# EAGLE schematic schematic1 (EAGLE 9.5.2)
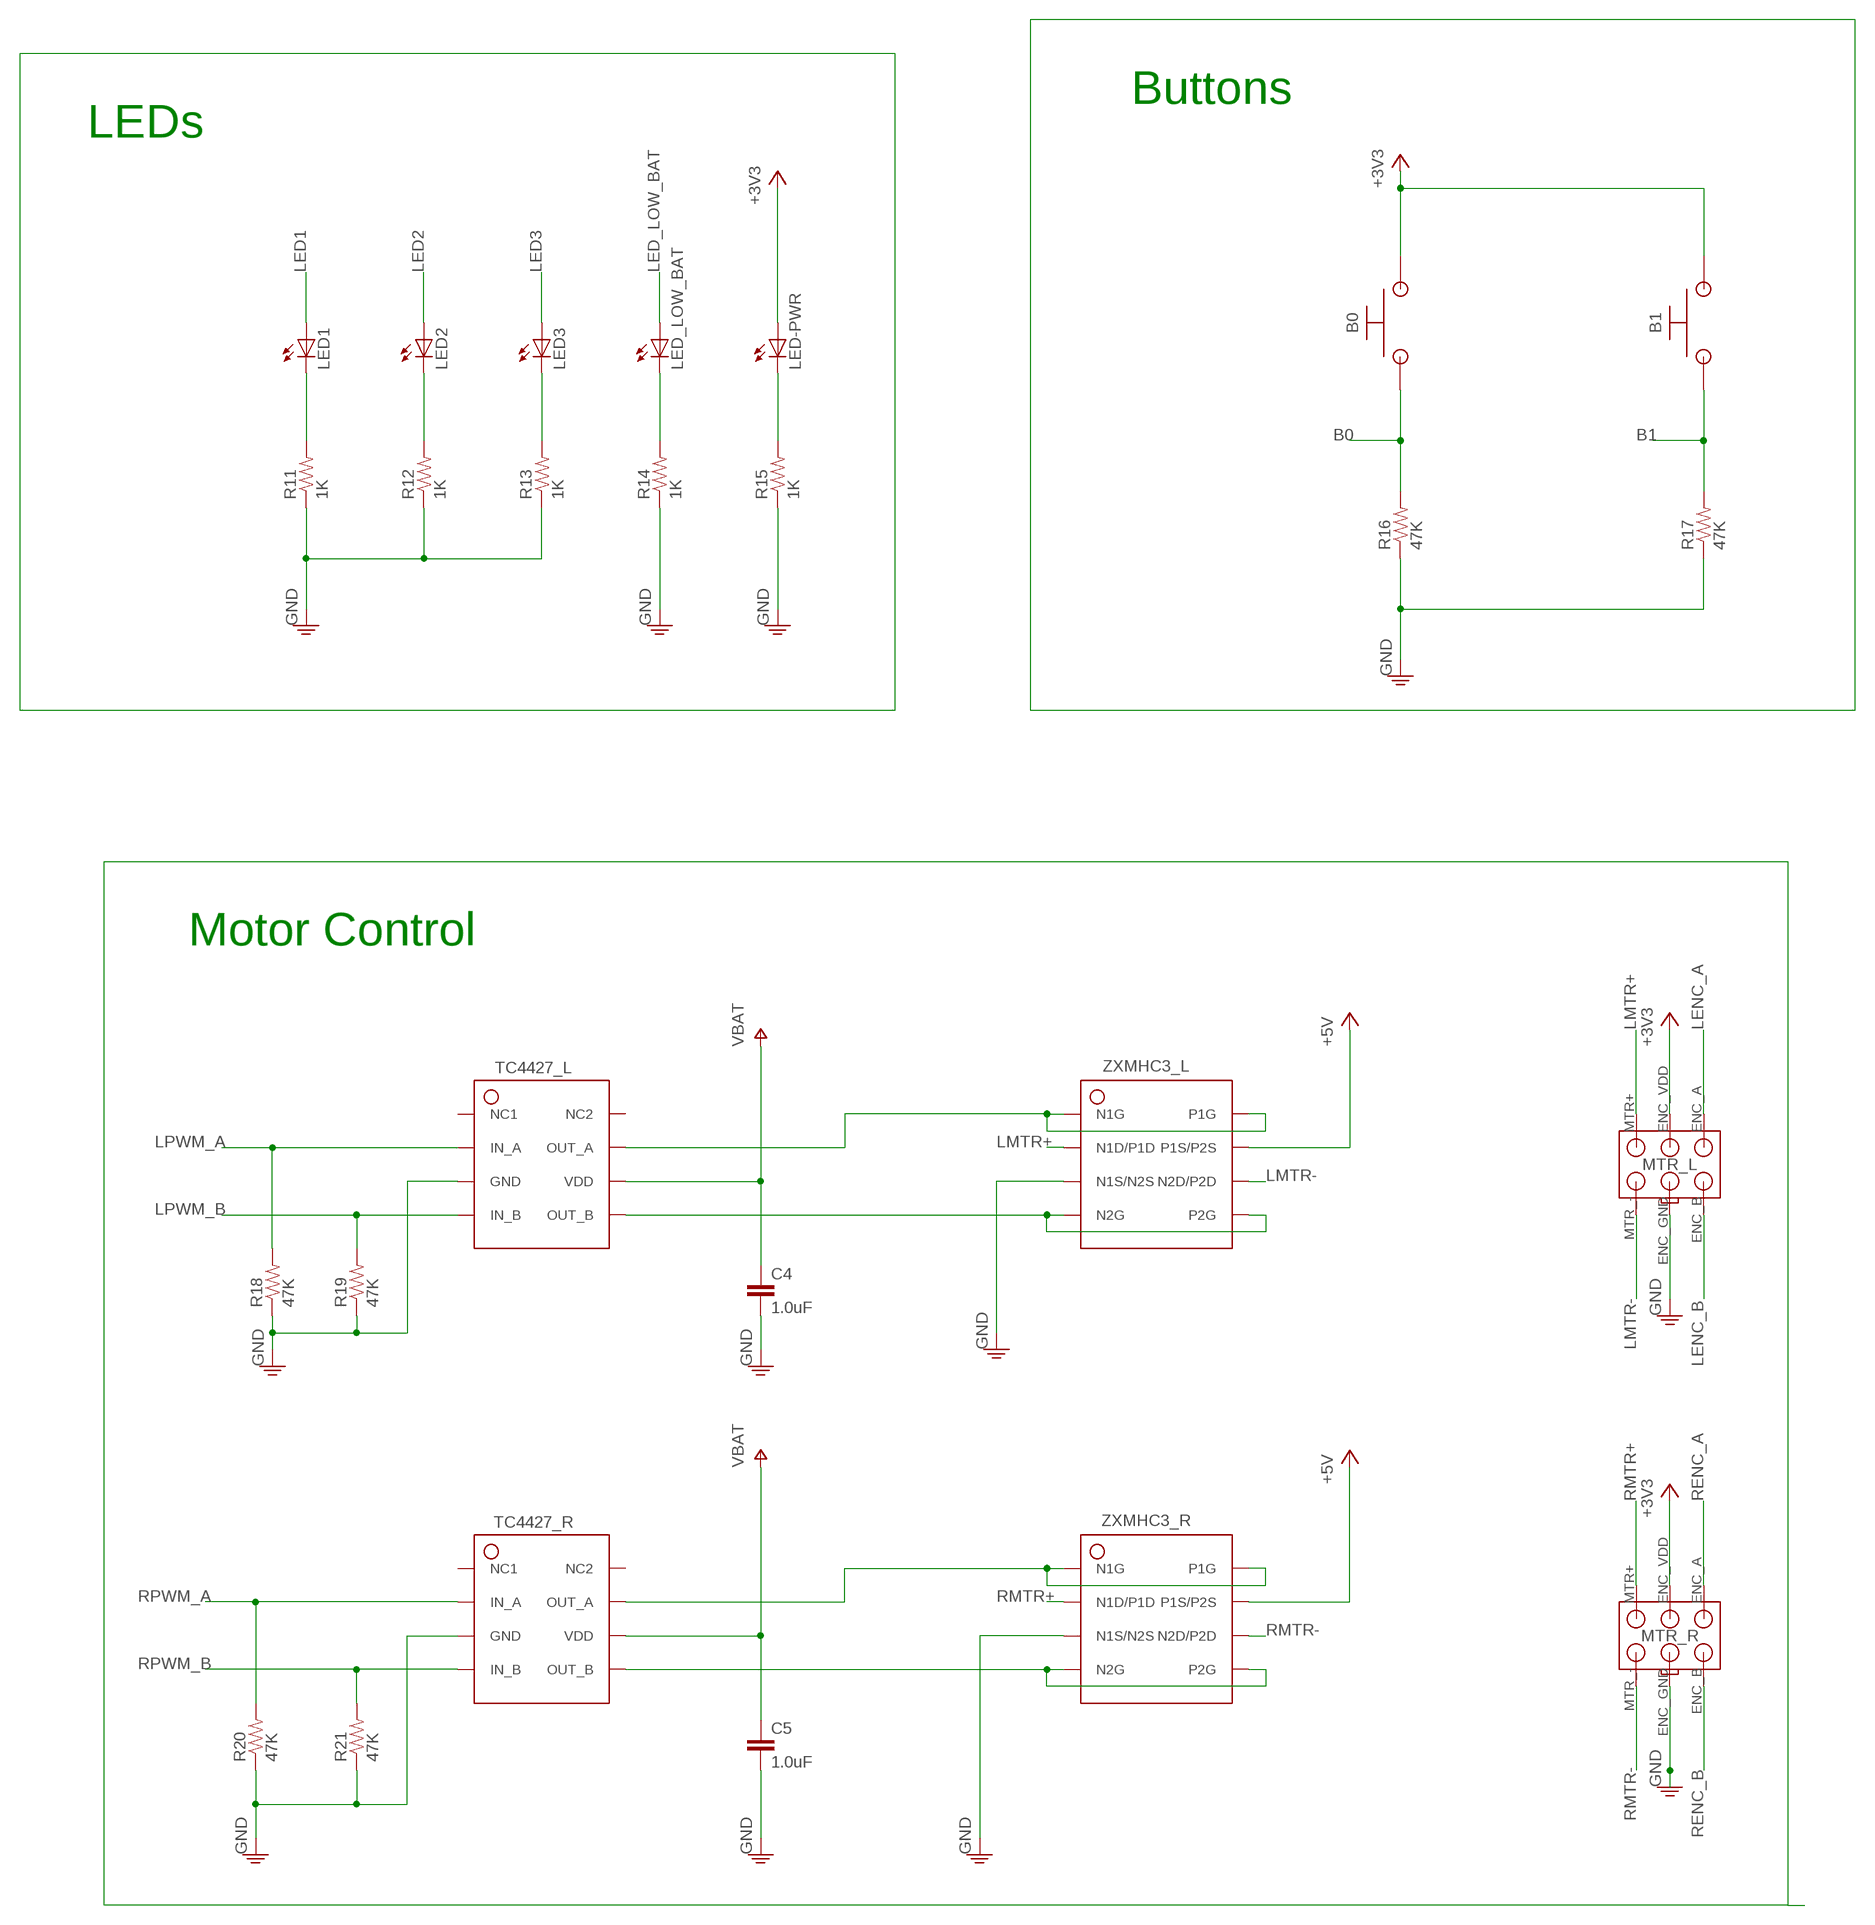
[diagram p0: schematic, sheet 1]

## Parts
B0  POLOLU_BUTTON  [POLOLU_BUTTON]
B1  POLOLU_BUTTON  [POLOLU_BUTTON]
C4  1.0uF  CAP_CERAMIC_0805IN_2012MM  [0805]
C5  1.0uF  CAP_CERAMIC_0805IN_2012MM  [0805]
LED1  LED  [LED-0805]
LED2  LED  [LED-0805]
LED3  LED  [LED-0805]
LED-PWR  LED  [LED-0805]
LED_LOW_BAT  LED  [LED-0805]
MTR_L  MOTOR_ENCODER_HEADER  [MOTOR_ENCODER_HEADER]
MTR_R  MOTOR_ENCODER_HEADER  [MOTOR_ENCODER_HEADER]
R11  1K  RESISTOR_0805IN_2012MM  [0805]
R12  1K  RESISTOR_0805IN_2012MM  [0805]
R13  1K  RESISTOR_0805IN_2012MM  [0805]
R14  1K  RESISTOR_0805IN_2012MM  [0805]
R15  1K  RESISTOR_0805IN_2012MM  [0805]
R16  47K  RESISTOR_0805IN_2012MM  [0805]
R17  47K  RESISTOR_0805IN_2012MM  [0805]
R18  47K  RESISTOR_0805IN_2012MM  [0805]
R19  47K  RESISTOR_0805IN_2012MM  [0805]
R20  47K  RESISTOR_0805IN_2012MM  [0805]
R21  47K  RESISTOR_0805IN_2012MM  [0805]
TC4427_L  TC4427_SOIC8  [TC4427_SOIC8]
TC4427_R  TC4427_SOIC8  [TC4427_SOIC8]
ZXMHC3_L  ZXMHC3  [ZXMHC3]
ZXMHC3_R  ZXMHC3  [ZXMHC3]

## Nets
+3V3: B0.P$2 B1.P$2 LED-PWR.A MTR_L.ENC_VDD MTR_R.ENC_VDD
+5V: ZXMHC3_L.P1S/P2S ZXMHC3_R.P1S/P2S
B0: B0.P$1 R16.2
B1: B1.P$1 R17.2
GND: C4.2 C5.2 MTR_L.ENC_GND MTR_R.ENC_GND R11.1 R12.1 R13.1 R14.1 R15.1 R16.1 R17.1 R18.1 R19.1 R20.1 R21.1 TC4427_L.GND TC4427_R.GND ZXMHC3_L.N1S/N2S ZXMHC3_R.N1S/N2S
LED1: LED1.A
LED2: LED2.A
LED3: LED3.A
LED_LOW_BAT: LED_LOW_BAT.A
LENC_A: MTR_L.ENC_A
LENC_B: MTR_L.ENC_B
LMTR+: MTR_L.MTR+(MTR_+) ZXMHC3_L.N1D/P1D
LMTR-: MTR_L.MTR_- ZXMHC3_L.N2D/P2D
LPWM_A: R18.2 TC4427_L.IN_A
LPWM_B: R19.2 TC4427_L.IN_B
N$2: LED1.C R11.2
N$3: TC4427_L.OUT_B ZXMHC3_L.N2G ZXMHC3_L.P2G
N$4: TC4427_L.OUT_A ZXMHC3_L.N1G ZXMHC3_L.P1G
N$6: LED2.C R12.2
N$7: LED3.C R13.2
N$9: TC4427_R.OUT_A ZXMHC3_R.N1G ZXMHC3_R.P1G
N$10: TC4427_R.OUT_B ZXMHC3_R.N2G ZXMHC3_R.P2G
N$12: LED_LOW_BAT.C R14.2
N$13: LED-PWR.C R15.2
RENC_A: MTR_R.ENC_A
RENC_B: MTR_R.ENC_B
RMTR+: MTR_R.MTR+(MTR_+) ZXMHC3_R.N1D/P1D
RMTR-: MTR_R.MTR_- ZXMHC3_R.N2D/P2D
RPWM_A: R20.2 TC4427_R.IN_A
RPWM_B: R21.2 TC4427_R.IN_B
V+: C4.1 C5.1 TC4427_L.VDD TC4427_R.VDD ; supply symbol labelled VBAT
Unconnected: TC4427_L.NC1 TC4427_L.NC2 TC4427_R.NC1 TC4427_R.NC2

## Notes on the sheet
- Buttons
- LEDs
- Motor Control

## Library data of the parts
B0 B1 = POLOLU_BUTTON:POLOLU_BUTTON
C4 C5 = CAP_CERAMIC_0805IN_2012MM:CAP_CERAMIC_0805IN_2012MM
LED1-LED3 LED-PWR LED_LOW_BAT = LED_0805:LED
MTR_L MTR_R = MOTOR_ENCODER_HEADER:MOTOR_ENCODER_HEADER
R11-R21 = RESISTOR_0805IN_2012MM:RESISTOR_0805IN_2012MM
TC4427_L TC4427_R = TC4427:TC4427_SOIC8
ZXMHC3_L ZXMHC3_R = ZXMHC3:ZXMHC3